# Altium project Energino.PrjPcb
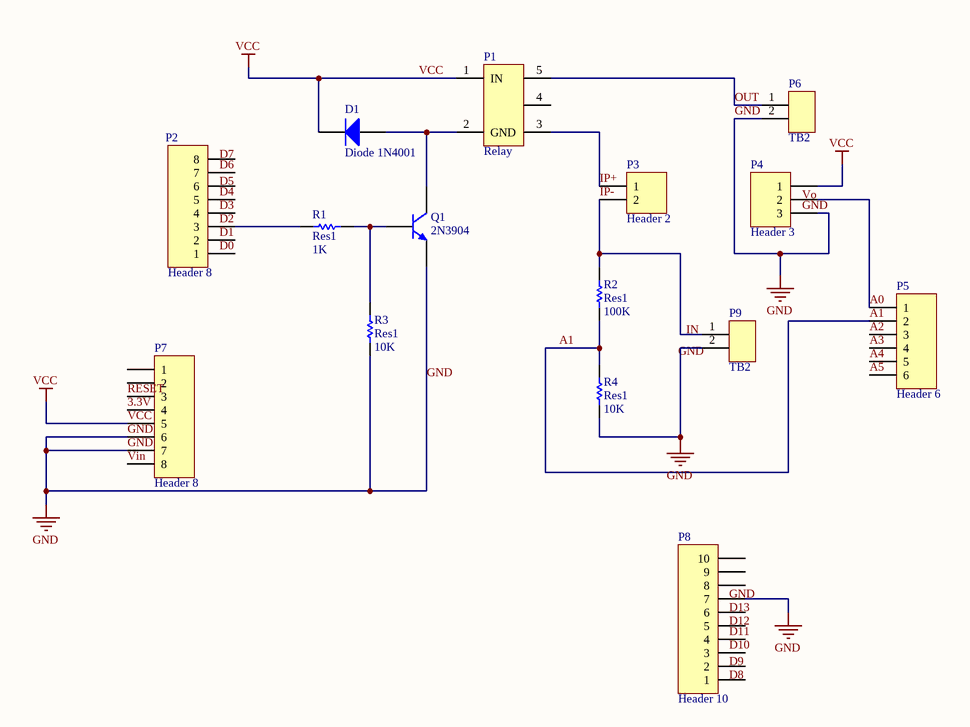
[diagram p0: Energino.SchDoc]
1 sheet, 15 parts. Net scope: global (net labels, ports and power ports of the same name join across sheets).
Board file: Energino.PcbDoc

## Sheet Energino.SchDoc
size A4; DrawnBy: Winton

### Parts
D1  Diode 1N4001  [DO-41]
P1  Relay  [JQC-3F]
P2  Header 8  [HDR1X8]
P3  Header 2  [HDR1X2]
P4  Header 3  [HDR1X3]
P5  Header 6  [HDR1X6]
P6  TB2  [TB2]
P7  Header 8  [HDR1X8]
P8  Header 10  [HDR1X10]
P9  TB2  [TB2]
Q1  2N3904  [TO-92A]
R1  Res1  value 1K  [AXIAL-0.3]
R2  Res1  value 100K  [AXIAL-0.3]
R3  Res1  value 10K  [AXIAL-0.3]
R4  Res1  value 10K  [AXIAL-0.3]

### Nets
GND: P4.3 P6.2 P7.6 P7.7 P8.7 P9.2 Q1.1(E) R3.1 R4.1
VCC: D1.2(K) P1.1(IN) P4.1 P7.5
3.3V: P7.4
A0: P4.2 P5.1
A1: P5.2 R2.1 R4.2
A2: P5.3
A3: P5.4
A4: P5.5
A5: P5.6
IP+: P1.3 P3.1
IP-: P3.2 P9.1 R2.2
OUT: P1.5 P6.1
RESET: P7.3
Vin: P7.8
NetD1_1: D1.1(A) P1.2(GND) Q1.3(C)
NetP2_3: P2.3 R1.1
NetQ1_2: Q1.2(B) R1.2 R3.2

Not connected (* = marked no-connect by the designer): P1 4; P2 1 2 4 5 6 7 8; P7 1 2; P8 1 2 3 4 5 6 8 9 10

### Notes on the sheet
- Labels drawn without touching a wire or pin: D0, D1, D2, D3, D4, D5, D6, D7, D8, D9, D10, D11, D12, D13, GND, IN, Vo

### Library data of the parts
D1 = Diode 1N4001: 1 Amp General Purpose Rectifier; Published: 8-Jun-2000; LatestRevisionDate: 17-Jul-2002; LatestRevisionNote: Re-released for DXP Platform.; DatasheetVersion: 1998; PackageVersion: Aug-1999; PackageReference: DO-41; Publisher: Altium Limited; PackageDescription: Diode, Axial; Body 5.2 x 2.7 mm (LxDia. max), Lead Dia. 0.86 mm (max); Code_JEDEC: DO-204-AL; ComponentLink1Description: Manufacturer Link; ComponentLink1URL: http://www.fairchildsemi.com/; ComponentLink2Description: Datasheet; ComponentLink2URL: http://www.fairchildsemi.com/ds/1N%2F1N4001.pdf
P1 = JQC-3F
P2 P7 = Header 8: Header, 8-Pin; LatestRevisionDate: 17-Jul-2002; LatestRevisionNote: Re-released for DXP Platform.; Publisher: Altium Limited
P3 = Header 2: Header, 2-Pin; LatestRevisionDate: 17-Jul-2002; LatestRevisionNote: Re-released for DXP Platform.; Publisher: Altium Limited
P4 = Header 3: Header, 3-Pin; LatestRevisionDate: 17-Jul-2002; LatestRevisionNote: Re-released for DXP Platform.; Publisher: Altium Limited
P5 = Header 6: Header, 6-Pin; LatestRevisionDate: 17-Jul-2002; LatestRevisionNote: Re-released for DXP Platform.; Publisher: Altium Limited
P8 = Header 10: Header, 10-Pin; LatestRevisionDate: 17-Jul-2002; LatestRevisionNote: Re-released for DXP Platform.; Publisher: Altium Limited
Q1 = 2N3904: NPN General Purpose Amplifier; Published: 8-Jun-2000; LatestRevisionDate: 15-Jan-2003; LatestRevisionNote: PCB Footprint 'BCY-W3/D4.7' replaced; DatasheetVersion: 1997; PackageVersion: Sep-1998; PackageReference: TO-92A; Publisher: Altium Limited; PackageDescription: TO, Flat Index; 3 In-Line, Axial Leads; Body Dia. 4.5mm; Leads 0.51 x 0.48 mm (max); ComponentLink1Description: Manufacturer Link; ComponentLink1URL: http://www.fairchildsemi.com/; ComponentLink2Description: Datasheet; ComponentLink2URL: http://www.fairchildsemi.com/ds/2N%2F2N3904.pdf
R1-R4 = Res1: Resistor; Published: 8-Jun-2000; LatestRevisionDate: 17-Jul-2002; LatestRevisionNote: Re-released for DXP Platform.; PackageReference: AXIAL-0.3; Publisher: Altium Limited; PackageDescription: Axial Device, Thru-Hole; 2 Leads; 0.3 in Pin Spacing